# Altium schematic sheet Middle_Arduino.SchDoc
size A4
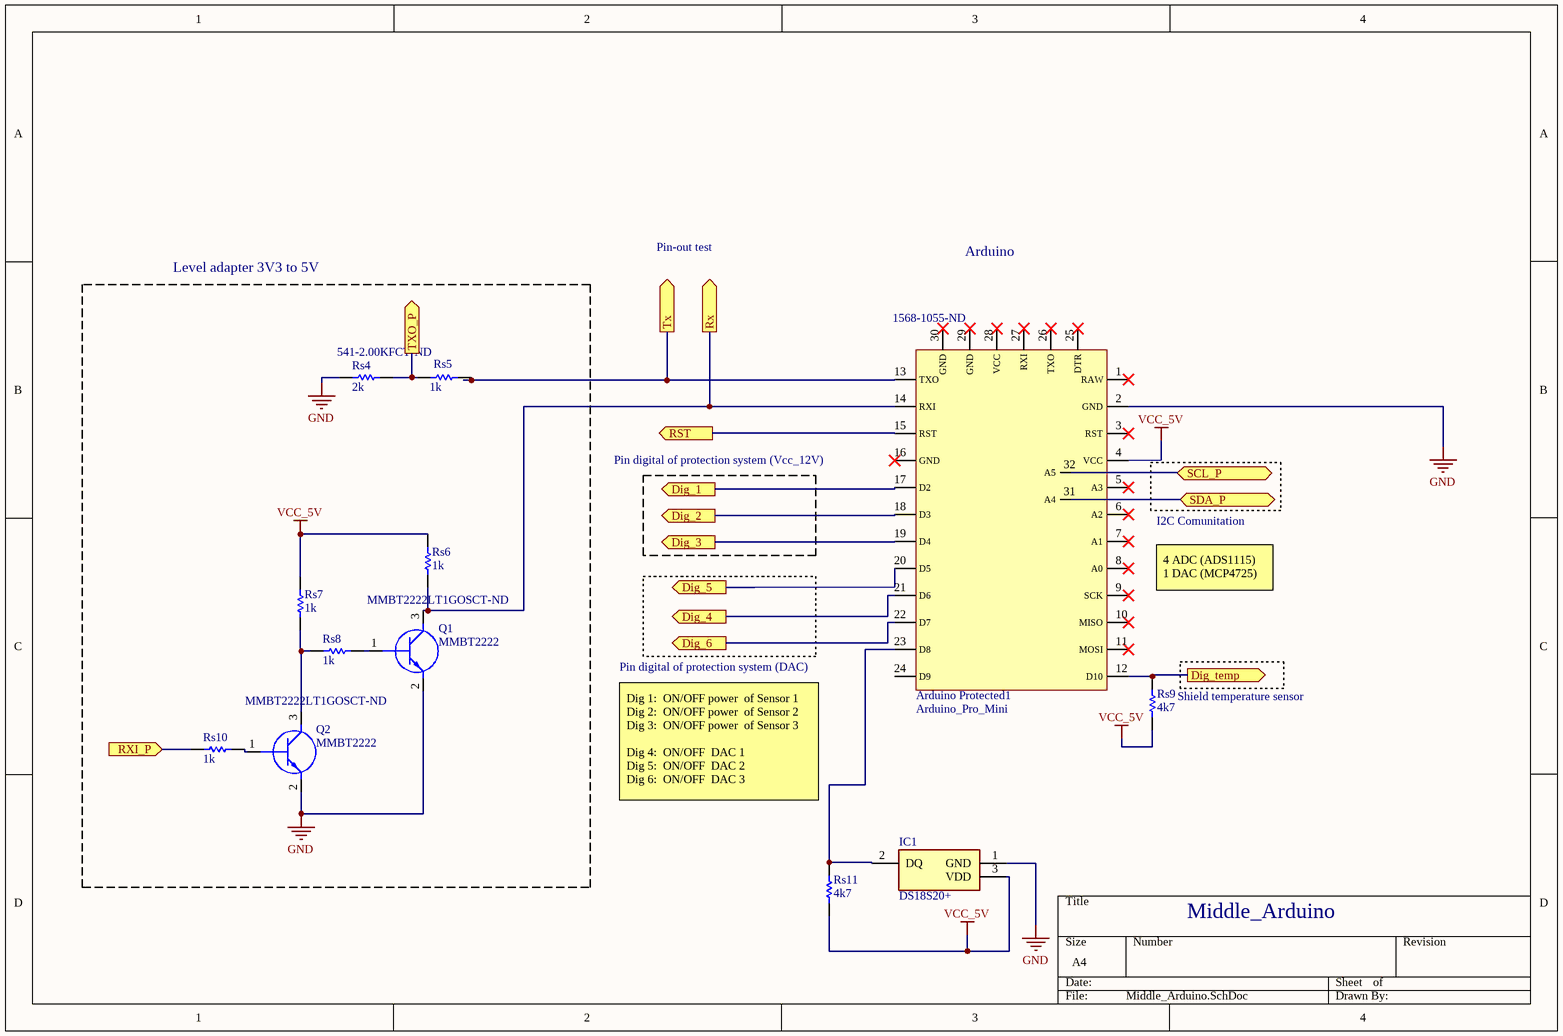
[diagram p0: Middle_Arduino.SchDoc]

## Parts
Arduino_Protected1  Arduino_Pro_Mini  Supplier Part Number 1: 1568-1055-ND  [Arduino_Pro_Mini]
IC1  DS18S20+  [ONSC-TO-92-3-29-11_AM_BL]
Q1  MMBT2222  Supplier Part Number 1: MMBT2222LT1GOSCT-ND  [SOT95P240X114-3N]
Q2  MMBT2222  Supplier Part Number 1: MMBT2222LT1GOSCT-ND  [SOT95P240X114-3N]
Rs4  2k  Supplier Part Number 1: 541-2.00KFCT-ND  [R1206]
Rs5  1k  [R1206]
Rs6  1k  [R1206]
Rs7  1k  [R1206]
Rs8  1k  [R1206]
Rs9  4k7  [R1206]
Rs10  1k  [R1206]
Rs11  4k7  [R1206]

## Blocks framed on the sheet
Level adapter 3V3 to 5V: Q1 Q2 Rs4-Rs8 Rs10

## Ports
Dig_1 (out), Dig_2 (out), Dig_3 (out), Dig_4 (out), Dig_5 (out), Dig_6 (out), Dig_temp (out), RST (out), Rx (out), RXI_P (in), SCL_P (bidir), SDA_P (bidir), Tx (out), TXO_P (out)

## Nets
GND: Arduino_Protected1.2(GND) IC1.1(GND) Q1.2(E) Q2.2(E) Rs4.1
VCC_5V: Arduino_Protected1.4(VCC) IC1.3(VDD) Rs6.2 Rs7.2 Rs9.1 Rs11.1
Dig_1: Arduino_Protected1.17(D2) ; port Dig_1
Dig_2: Arduino_Protected1.18(D3) ; port Dig_2
Dig_3: Arduino_Protected1.19(D4) ; port Dig_3
Dig_4: Arduino_Protected1.21(D6) ; port Dig_4
Dig_5: Arduino_Protected1.20(D5) ; port Dig_5
Dig_6: Arduino_Protected1.22(D7) ; port Dig_6
Dig_temp: Arduino_Protected1.12(D10) Rs9.2 ; port Dig_temp
RST: Arduino_Protected1.15(RST) ; port RST
Rx: Arduino_Protected1.14(RXI) Q1.3(C) Rs6.1 ; port Rx
RXI_P: Rs10.1 ; port RXI_P
SCL_P: Arduino_Protected1.32(A5) ; port SCL_P
SDA_P: Arduino_Protected1.31(A4) ; port SDA_P
Tx: Arduino_Protected1.13(TXO) Rs5.2 ; port Tx
TXO_P: Rs4.2 Rs5.1 ; port TXO_P
NetArduino_Protected1_23: Arduino_Protected1.23(D8) IC1.2(DQ) Rs11.2
NetQ1_1: Q1.1(B) Rs8.1
NetQ2_1: Q2.1(B) Rs10.2
NetQ2_3: Q2.3(C) Rs7.1 Rs8.2

Not connected (* = marked no-connect by the designer): Arduino_Protected1 1(RAW)* 3(RST)* 5(A3)* 6(A2)* 7(A1)* 8(A0)* 9(SCK)* 10(MISO)* 11(MOSI)* 16(GND)* 24(D9) 25(DTR)* 26(TXO)* 27(RXI)* 28(VCC)* 29(GND)* 30(GND)*

## Notes on the sheet
- Pin-out test
- Arduino
- (near Arduino_Protected1) Pin digital of protection system (Vcc_12V)
- (near Arduino_Protected1) I2C Comunitation
- (near Arduino_Protected1) 4 ADC (ADS1115)
  1 DAC (MCP4725)
- Pin digital of protection system (DAC)
- (near Rs9) Shield temperature sensor
- Dig 1:  ON/OFF power  of Sensor 1
  Dig 2:  ON/OFF power  of Sensor 2
  Dig 3:  ON/OFF power  of Sensor 3
  Dig 4:  ON/OFF  DAC 1
  Dig 5:  ON/OFF  DAC 2
  Dig 6:  ON/OFF  DAC 3
- Middle_Arduino

## Library data of the parts
IC1 = DS18S20+: Integrated Circuit; Manufacturer_Name: Maxim Integrated; Datasheet Link: https://datasheets.maximintegrated.com/en/ds/DS18S20.pdf; Height: 4.95mm; Manufacturer_Part_Number: DS18S20+; Mouser Part Number: 700-DS18S20; Mouser Price/Stock: https://www.mouser.co.uk/ProductDetail/Maxim-Integrated/DS18S20%2b?qs=0Y9aZN%252BMVCVr8Q2h8Exw2w%3D%3D
Q1 Q2 = MMBT2222: Transistor BJT NPN; Manufacturer_Name: ON Semiconductor; Datasheet Link: https://componentsearchengine.com/Datasheets/1/MMBT2222.pdf; Height: 1.14mm; Manufacturer_Part_Number: MMBT2222; Mouser Part Number: 512-MMBT2222; Mouser Price/Stock: https://www.mouser.co.uk/ProductDetail/ON-Semiconductor-Fairchild/MMBT2222/?qs=UMEuL5FsraD0NR7loUMuuw%3D%3D; Supplier 1: Digi-Key
Rs4-Rs11 = R1206: 1206 Resistor  1% CMP2010A 1Watt 100ppm; Value: *; Supplier 1: Digi-Key
  Rs5-Rs11: Supplier Part Number 1: 541-CRCW12061K00FKEBCT-ND
Arduino_Protected1 = Arduino_Pro_Mini: Supplier 1: Digi-Key